# EAGLE design Extension S-E (EAGLE 9.3.2)
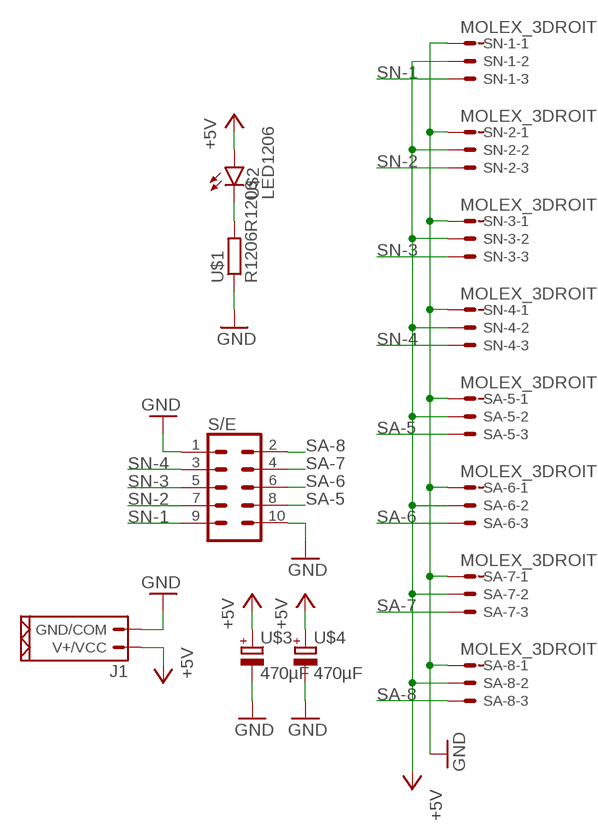
[diagram p0: schematic, sheet 1]

## Parts
J1  MOLEX_2_PUISS90°  [CON_2_PUISS_90°]
S/E  CON_5X2SHD  [2X5-SHROUDED]
SA-5  MOLEX_3DROIT  [CON_3_DROIT]
SA-6  MOLEX_3DROIT  [CON_3_DROIT]
SA-7  MOLEX_3DROIT  [CON_3_DROIT]
SA-8  MOLEX_3DROIT  [CON_3_DROIT]
SN-1  MOLEX_3DROIT  [CON_3_DROIT]
SN-2  MOLEX_3DROIT  [CON_3_DROIT]
SN-3  MOLEX_3DROIT  [CON_3_DROIT]
SN-4  MOLEX_3DROIT  [CON_3_DROIT]
U$1  R1206R1206  [R1206]
U$2  LED1206  [1206]
U$3  470µF  CONDO3.5-8  [E3,5-8]
U$4  470µF  CONDO3.5-8  [E3,5-8]

## Nets
+5V: J1.P$2(V+/VCC) SA-5.2 SA-6.2 SA-7.2 SA-8.2 SN-1.2 SN-2.2 SN-3.2 SN-4.2 U$2.A U$3.+ U$4.+
GND: J1.P$1(GND/COM) S/E.1 S/E.10 SA-5.1 SA-6.1 SA-7.1 SA-8.1 SN-1.1 SN-2.1 SN-3.1 SN-4.1 U$1.1 U$3.- U$4.-
N$1: U$1.2 U$2.C
SA-5: S/E.8 SA-5.3
SA-6: S/E.6 SA-6.3
SA-7: S/E.4 SA-7.3
SA-8: S/E.2 SA-8.3
SN-1: S/E.9 SN-1.3
SN-2: S/E.7 SN-2.3
SN-3: S/E.5 SN-3.3
SN-4: S/E.3 SN-4.3

## Library data of the parts
J1 = AREA:MOLEX_2_PUISS: Solid Header 3.96mm KK ,r/a,F/Lock,2w Molex KK Series, Series Number 41792, 3.96mm Pitch 2 Way 1 Row Right Angle PCB Header, Solder Termination, 7A Source: Datasheet <http://www.molex.com/webdocs/datasheets/pdf/en-us/0026605020_PCB_HEADERS.pdf>
S/E = AREA:CON_5X2: Multi connection point. Often used as Generic Header-pin footprint for 0.1 inch spaced/style header connections For AVR SPI programming port, see special device with nice symbol: "AVR_SPI_PROG_5x2.dev" You can populate with any combo of single row headers, but if you'd like an exact match, check these: 2x5 AVR ICSP Male Header <https://www.sparkfun.com/products/778> (PRT-00778) 2x5 Pin Shrouded Header <https://www.sparkfun.com/products/8506> (PRT-08506) On any of the 0.1 inch spaced packages, you can populate with these: Break Away Headers - Straight <https://www.sparkfun.com/products/116> (PRT-00116) Break Away Male Headers - Right Angle <https://www.sparkfun.com/products/553> (PRT-00553) Female Headers <https://www.sparkfun.com/products/115> (PRT-00115) Break Away Headers - Machine Pin <https://www.sparkfun.com/products/117> (PRT-00117) Break Away Female Headers - Swiss Machine Pin <https://www.sparkfun.com/products/743> (PRT-00743) Special note: the shrouded connector mates well with our 5x2 ribbon cables: 2x5 Pin IDC Ribbon Cable <https://www.sparkfun.com/products/8535> (PRT-08535); PROD_ID: CONN-08671; SF_ID: PRT-08506
SA-5-SA-8 SN-1-SN-4 = AREA:MOLEX_3: CONNECTOR wire to board 2.54 mm (.1 inch) pitch header; MF: MOLEX; OC_FARNELL: unknown; OC_NEWARK: unknown
U$1 = AREA:R1206
U$2 = AREA:LED1206
U$3 U$4 = AREA:CONDO

## Board
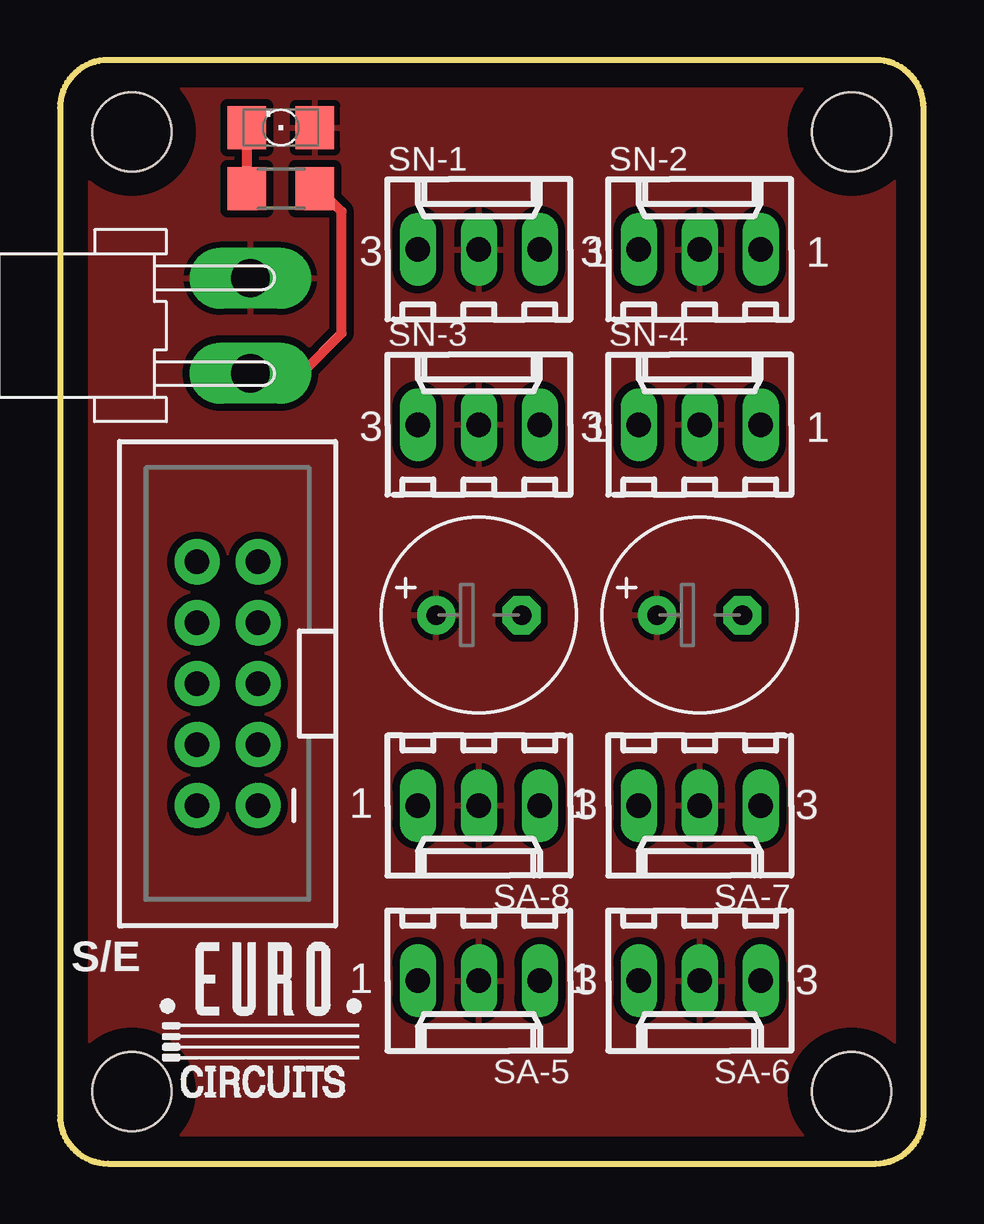
[diagram p1: board, top side]
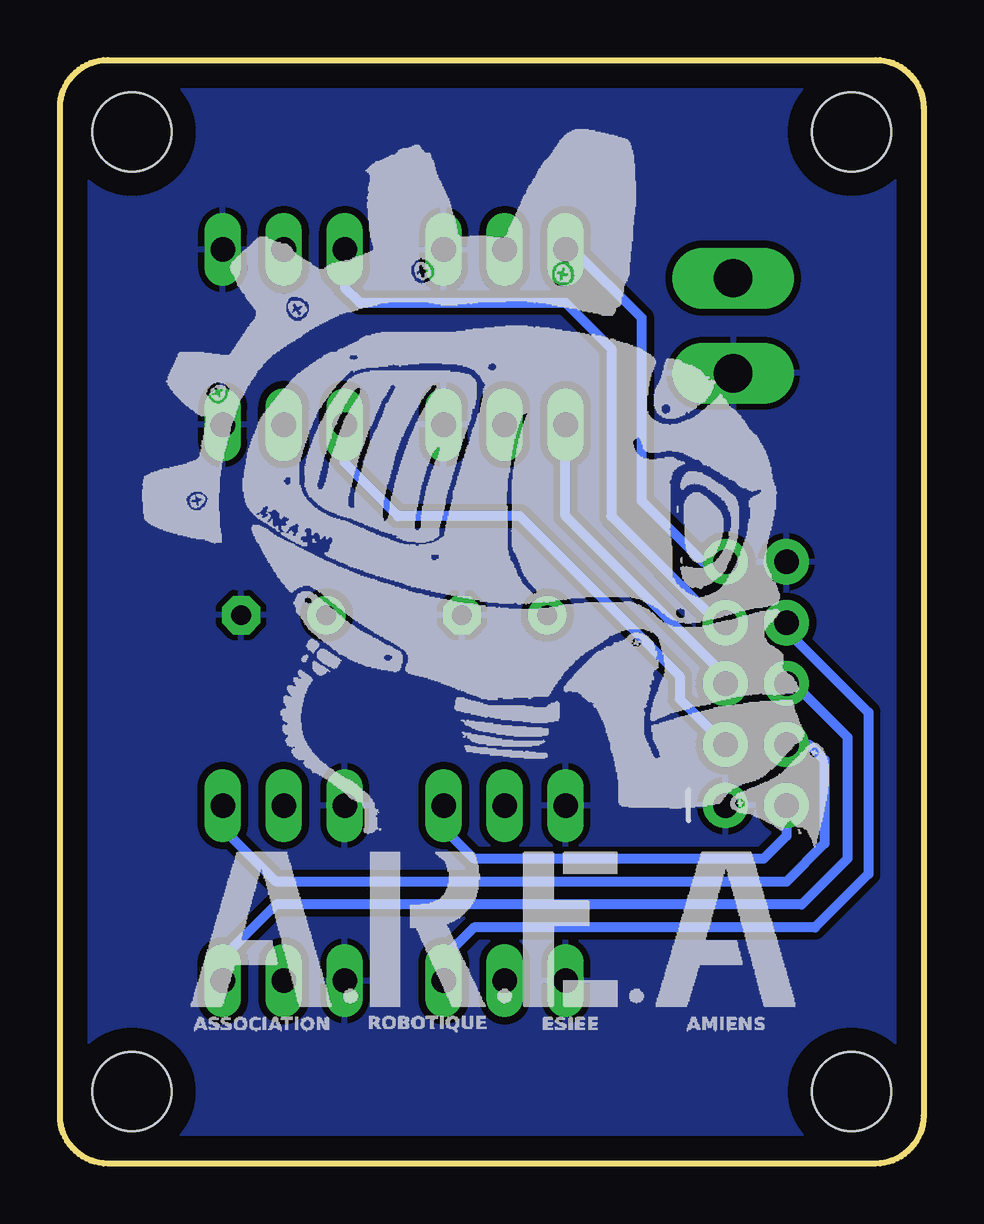
[diagram p2: board, bottom side, seen from below]

Size 36 x 46 mm. Coordinates in mm from the lower left corner, seen from the top.
Outline: 0,2 arc90 2,0 34,0 arc90 36,2 36,44 arc90 34,46 2,46 arc90 0,44 0,2
Copper layers (1*16): Top 0.035mm / dielectric 1.5mm / Bottom 0.035mm
Design rules "default *": minimum track width 12mil, minimum drill 0.35mm, track to track 12mil, track to pad 12mil, pad to pad 12mil, via to via 12mil, smd to smd 10mil, copper to edge 40mil, drill to drill 6mil, minimum pad ring 10mil, minimum via ring 8mil, stop-mask expansion 4mil, vias tented up to drill 0mil, thermal gap 10mil
Holes 3.3 mm at 33,3 33,43 3,43 3,3

### Footprints (pad centres in the part's own frame; a part is rotated, then mirrored left to right if it is on the bottom)
CON_2_PUISS_90° = drill 1.6 pad 2.54 long: P$1 -1.98,0; P$2 1.98,0
2X5-SHROUDED = drill 1.016 pad 1.88: 1 -1.27,5.08; 2 1.27,5.08; 3 -1.27,2.54; 4 1.27,2.54; 5 -1.27,0; 6 1.27,0; 7 -1.27,-2.54; 8 1.27,-2.54; 9 -1.27,-5.08; 10 1.27,-5.08
CON_3_DROIT = drill 1.016 long: 1 2.54,0; 2 0,0; 3 -2.54,0
R1206 = smd 1.6 x 1.803: 1 -1.422,0; 2 1.422,0
1206 = smd 1.6 x 1.803: A -1.422,0; C 1.422,0
E3,5-8 = drill 0.813 pad 1.6: + -1.778,0 | drill 0.813 pad 1.6 octagon: - 1.778,0

### Placement (x,y rotation side)
J1  7.94,34.92 90 top
S/E  6.99,20 180 top
SA-5  17.46,7.62 180 top
SA-6  26.67,7.62 180 top
SA-7  26.67,14.92 180 top
SA-8  17.46,14.92 180 top
SN-1  17.46,38.1 0 top
SN-2  26.67,38.1 0 top
SN-3  17.46,30.8 0 top
SN-4  26.67,30.8 0 top
U$1  9.21,40.64 180 top
U$2  9.21,43.18 180 top
U$3  26.67,22.86 0 top
U$4  17.46,22.86 0 top

### Tracks (layer width: path | path; a pad name or v marks a point on that pad's centre or on a via)
+5V
  pour Top: -7.62,52.39 -7.62,-5.08 45.4,-5.08 45.4,52.39
GND
  Top 0.406: J1.P$1 10.09,32.95 11.75,34.61 11.75,39.69 10.79,40.64 U$1.1
  pour Bottom: -4.13,49.85 -4.13,-3.49 40.01,-3.49 40.01,49.85
N$1
  Top 0.406: U$2.C U$1.2
SA-5
  Bottom 0.406: S/E.8 5.71,22.23 2.3,18.81 2.3,12.06 4.52,9.84 18.73,9.84 20,8.57 SA-5.3
SA-6
  Bottom 0.406: S/E.6 5.4,20 3.17,17.78 3.17,12.7 5.08,10.79 26.99,10.79 29.21,8.57 SA-6.3
SA-7
  Bottom 0.406: S/E.4 4.76,17.46 4.13,16.83 4.13,13.34 5.71,11.75 26.99,11.75 29.21,13.97 SA-7.3
SA-8
  Bottom 0.406: S/E.2 5.71,13.65 6.67,12.7 18.73,12.7 20,13.97 SA-8.3
SN-1
  Bottom 0.406: S/E.9 9.21,25.08 11.75,27.62 11.75,35.24 14.61,38.1 SN-1.3
SN-2
  Bottom 0.406: SN-2.3 24.13,36.51 23.5,35.88 14.92,35.88 13.02,33.97 13.02,26.99 8.57,22.54 S/E.7
SN-3
  Bottom 0.406: S/E.5 8.26,20.32 14.92,26.99 SN-3.3
SN-4
  Bottom 0.406: S/E.3 10.16,19.37 10.16,20.32 16.83,26.99 21.91,26.99 24.13,29.21 SN-4.3